# EAGLE schematic ll-tester (EAGLE 9.6.2)
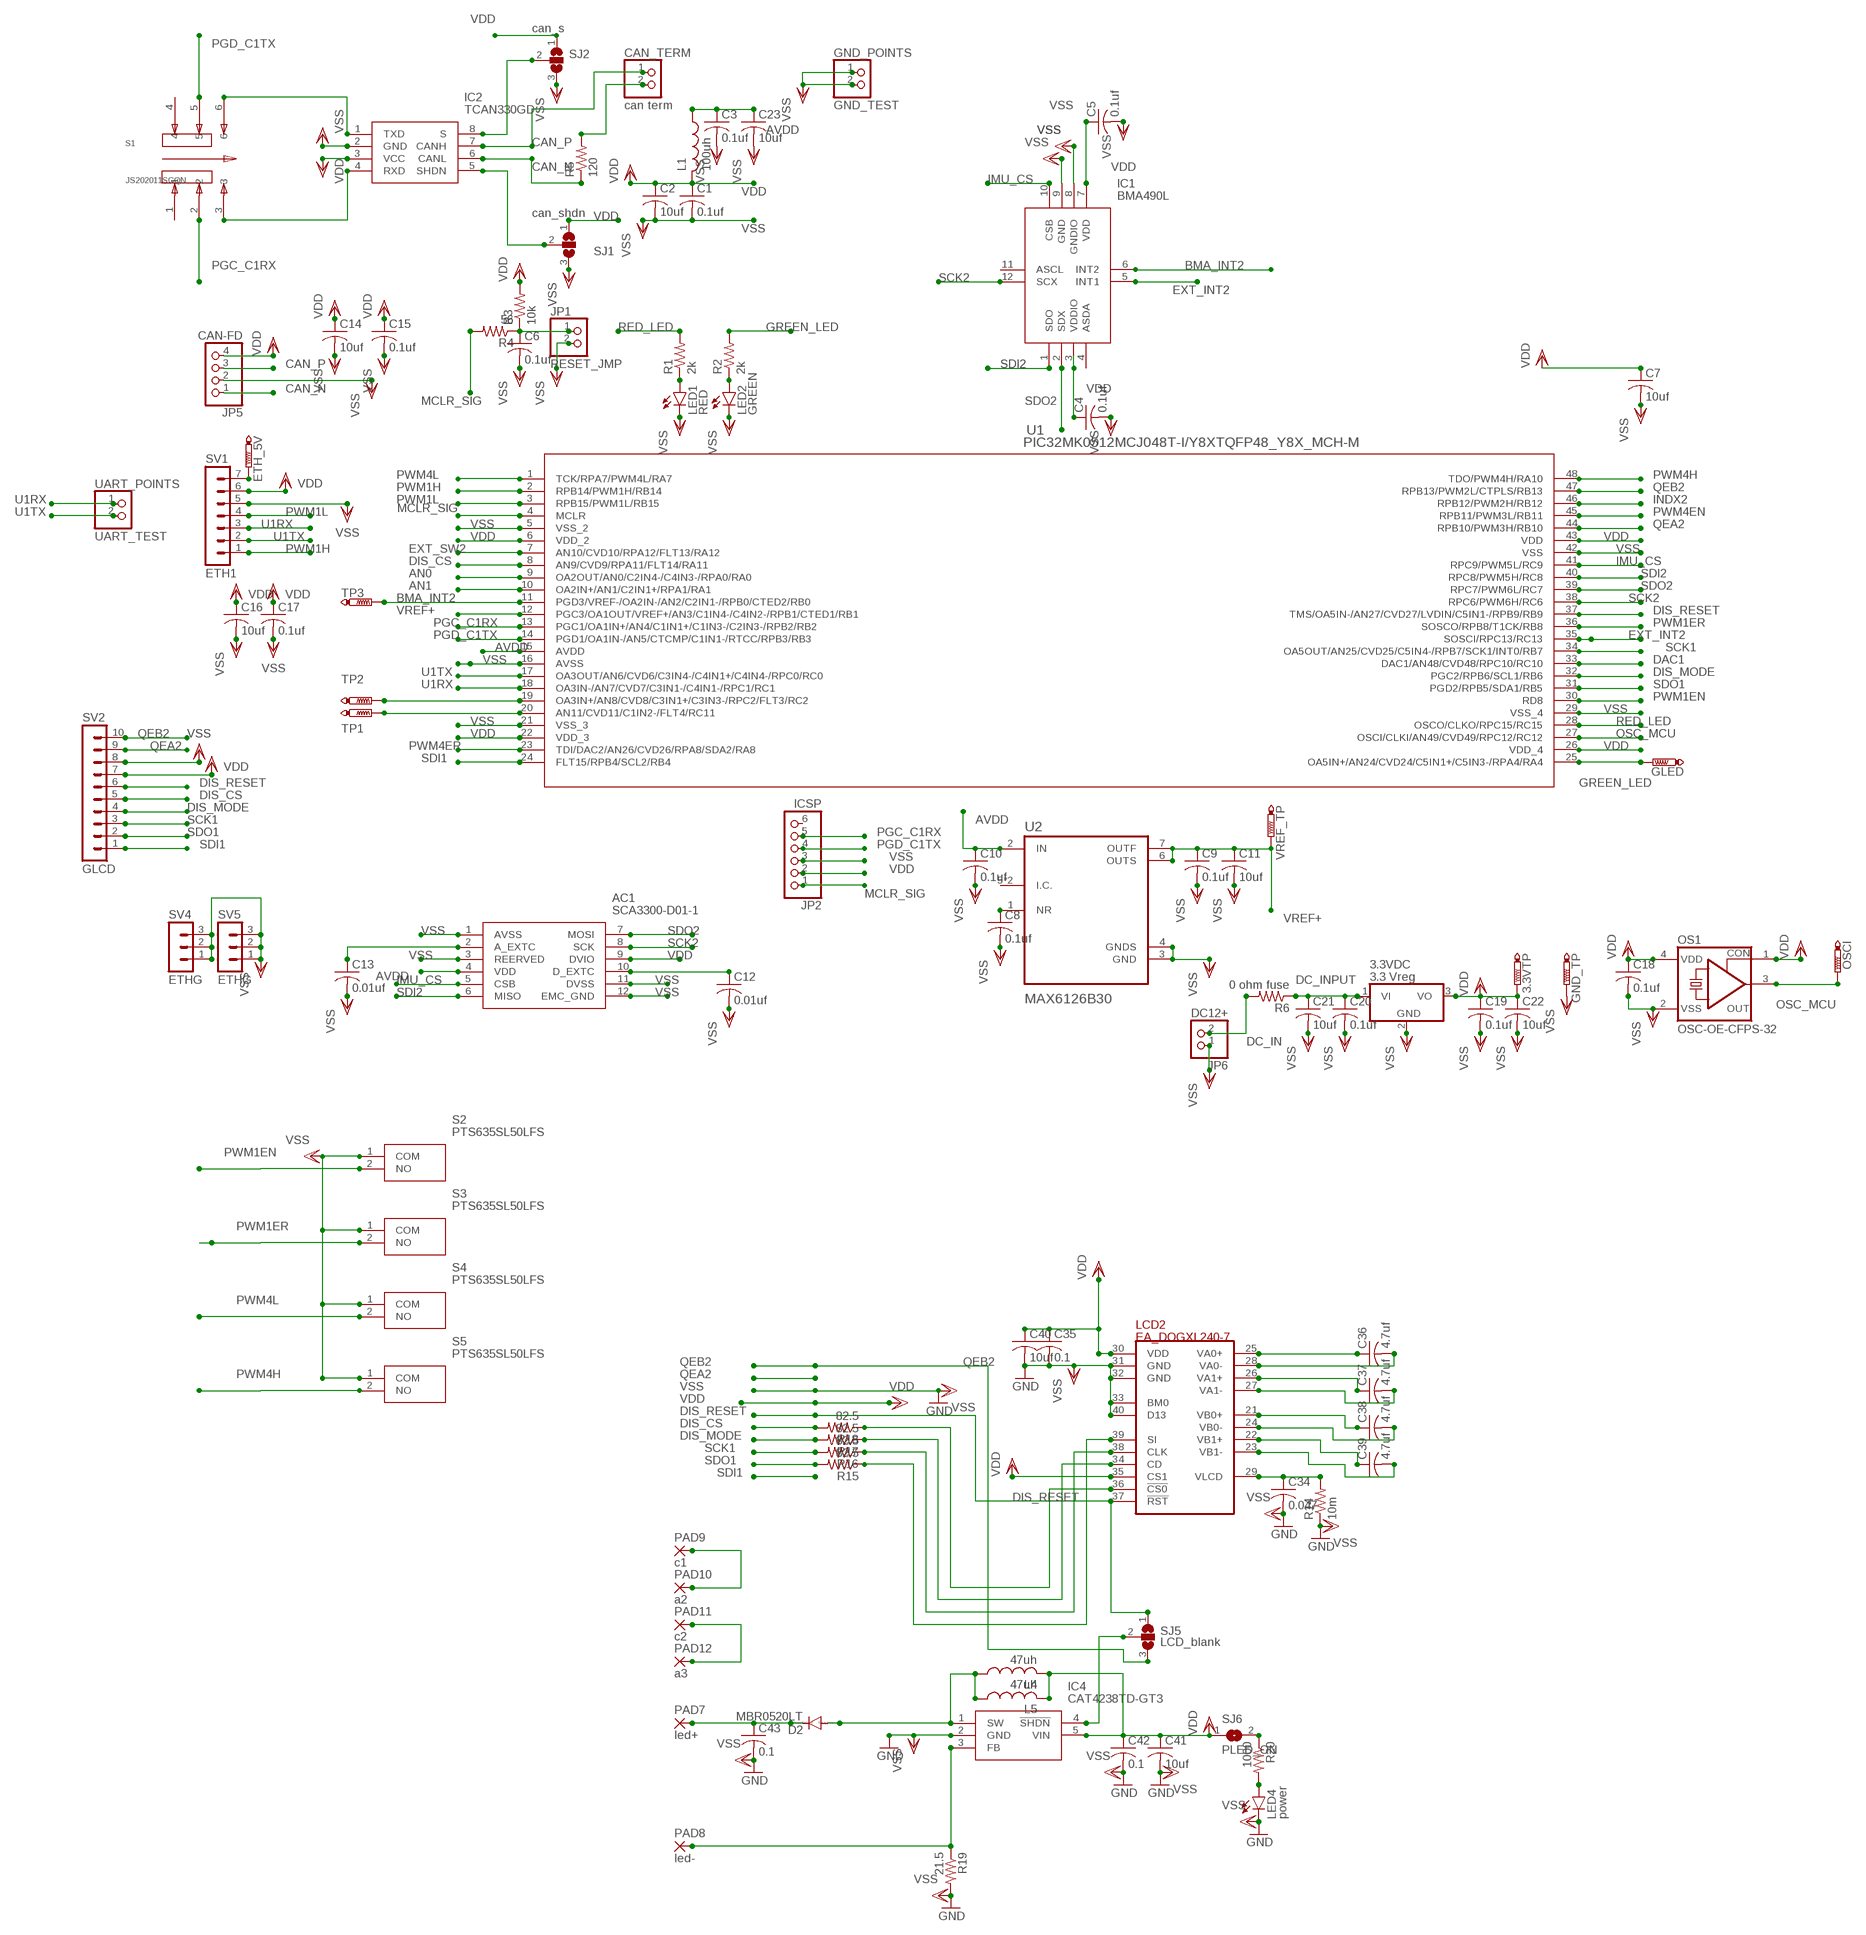
[diagram p0: schematic, sheet 1]

## Parts
3.3VDC  3.3 Vreg  7805TV  [TO220V]
3.3VTP  PTR1PAD1-13  [P1-13]
AC1  SCA3300-D01-1  [SCA3300]
C1  0.1uf  C-USC0805  [C0805]
C2  10uf  C-USC0805  [C0805]
C3  0.1uf  C-USC0805  [C0805]
C4  0.1uf  C-USC0805  [C0805]
C5  0.1uf  C-USC0805  [C0805]
C6  0.1uf  C-USC0805  [C0805]
C7  10uf  C-USC0805  [C0805]
C8  0.1uf  C-USC0805  [C0805]
C9  0.1uf  C-USC0805  [C0805]
C10  0.1uf  C-USC0805  [C0805]
C11  10uf  C-USC0805  [C0805]
C12  0.01uf  C-USC0805  [C0805]
C13  0.01uf  C-USC0805  [C0805]
C14  10uf  C-USC0805  [C0805]
C15  0.1uf  C-USC0805  [C0805]
C16  10uf  C-USC0805  [C0805]
C17  0.1uf  C-USC0805  [C0805]
C18  0.1uf  C-USC0805  [C0805]
C19  0.1uf  C-USC0805  [C0805]
C20  0.1uf  C-USC0805  [C0805]
C21  10uf  C-USC0805  [C0805]
C22  10uf  C-USC0805  [C0805]
C23  10uf  C-USC0805  [C0805]
C34  0.047  C-USC1206  [C1206]
C35  0.1  C-USC1206  [C1206]
C36  4.7uf  C-USC1206  [C1206]
C37  4.7uf  C-USC1206  [C1206]
C38  4.7uf  C-USC1206  [C1206]
C39  4.7uf  C-USC1206  [C1206]
C40  10uf  C-USC1206  [C1206]
C41  10uf  C-USC1206  [C1206]
C42  0.1  C-USC1206  [C1206]
C43  0.1  C-USC1206  [C1206]
CAN_TERM  can term  PINHD-1X2  [1X02]
D2  MBR0520LT  [SOD123]
ETH_5V  PTR1PAD1-13  [P1-13]
GLED  PTR1PAD1-13  [P1-13]
GND_POINTS  GND_TEST  PINHD-1X2  [1X02]
GND_TP  PTR1PAD1-13  [P1-13]
IC1  BMA490L  [BMA490L]
IC2  TCAN330GD  [SOIC127P600X175-8N]
IC4  CAT4238TD-GT3  [SOT95P280X100-5N]
JP1  RESET_JMP  PINHD-1X2  [1X02]
JP2  ICSP  PINHD-1X6  [1X06]
JP5  CAN-FD  PINHD-1X4/90  [1X04/90]
JP6  DC12+  PINHD-1X2  [1X02]
L1  100uh  L-USL3216C  [L3216C]
L4  47uh  L-US0204/5  [0204/5]
L5  47uh  L-USL2012C  [L2012C]
LCD2  EA_DOGXL240-7  [EA_DOGXL240-7]
LED1  RED  LEDCHIPLED_0603  [CHIPLED_0603]
LED2  GREEN  LEDCHIPLED_0603  [CHIPLED_0603]
LED4  power  LEDSML0805  [SML0805]
OS1  OSC-OE-CFPS-32  [7.2X5.2-4-PAD]
OSCI  PTR1PAD1-13  [P1-13]
PAD7  led+  1,6/0,8  [1,6/0,8]
PAD8  led-  1,6/0,8  [1,6/0,8]
PAD9  c1  1,6/0,8  [1,6/0,8]
PAD10  a2  1,6/0,8  [1,6/0,8]
PAD11  c2  1,6/0,8  [1,6/0,8]
PAD12  a3  1,6/0,8  [1,6/0,8]
R1  2k  R-US_M0805  [M0805]
R2  2k  R-US_M0805  [M0805]
R3  10k  R-US_M0805  [M0805]
R4  56  R-US_M0805  [M0805]
R5  120  R-US_M0805  [M0805]
R6  0 ohm fuse  R-US_M1206  [M1206]
R14  10m  R-US_R0805  [R0805]
R15  82.5  R-US_R0805  [R0805]
R16  82.5  R-US_R0805  [R0805]
R17  82.5  R-US_R0805  [R0805]
R18  82.5  R-US_R0805  [R0805]
R19  21.5  R-US_R0805  [R0805]
R20  1000  R-US_R0805  [R0805]
S1  JS202011SCQN  [SW_JS202011SCQN]
S2  PTS635SL50LFS  [PTS635SL50LFS]
S3  PTS635SL50LFS  [PTS635SL50LFS]
S4  PTS635SL50LFS  [PTS635SL50LFS]
S5  PTS635SL50LFS  [PTS635SL50LFS]
SJ1  can_shdn  SJ2W  [SJ_2]
SJ2  can_s  SJ2W  [SJ_2]
SJ5  LCD_blank  SJ2W  [SJ_2]
SJ6  PLED_ON  SJ  [SJ]
SV1  ETH1  MA07-1  [MA07-1]
SV2  GLCD  MA10-1  [MA10-1]
SV4  ETHG  MA03-1  [MA03-1]
SV5  ETHG  MA03-1  [MA03-1]
TP1  PTR1PAD1-13  [P1-13]
TP2  PTR1PAD1-13  [P1-13]
TP3  PTR1PAD1-13  [P1-13]
U1  PIC32MK0512MCJ048T-I/Y8XTQFP48_Y8X_MCH-M  [TQFP48_Y8X_MCH-M]
U2  MAX6126B30  [SOP65P490X110-8N]
UART_POINTS  UART_TEST  PINHD-1X2  [1X02]
VREF_TP  PTR1PAD1-13  [P1-13]

## Nets
AN0: U1.9(OA2OUT/AN0/C2IN4-/C4IN3-/RPA0/RA0)
AN1: U1.10(OA2IN+/AN1/C2IN1+/RPA1/RA1)
AVDD [led]: AC1.4(VDD) C3.1 C10.1 C23.1 L1.1 U1.15(AVDD) U2.2(IN)
BMA_INT2: IC1.6(INT2) TP3.TP U1.11(PGD3/VREF-/OA2IN-/AN2/C2IN1-/RPB0/CTED2/RB0)
CAN_N [diff_can]: IC2.6(CANL) JP5.1 R5.1
CAN_P [diff_can]: CAN_TERM.1 IC2.7(CANH) JP5.3
DAC1: U1.33(DAC1/AN48/CVD48/RPC10/RC10)
DC_IN [icurrent]: JP6.2 R6.2
DC_INPUT [icurrent]: 3.3VDC.1(VI) C20.1 C21.1 R6.1
DIS_CS: R18.2 SV2.5 U1.8(AN9/CVD9/RPA11/FLT14/RA11)
DIS_MODE: R17.2 SV2.4 U1.32(PGC2/RPB6/SCL1/RB6)
DIS_RESET: LCD2.37(!RST!) SJ5.1 SV2.6 U1.37(TMS/OA5IN-/AN27/CVD27/LVDIN/C5IN1-/RPB9/RB9)
EXT_INT2: IC1.5(INT1) U1.35(SOSCI/RPC13/RC13)
EXT_SW2: U1.7(AN10/CVD10/RPA12/FLT13/RA12)
GREEN_LED: GLED.TP R2.2 U1.25(OA5IN+/AN24/CVD24/C5IN1+/C5IN3-/RPA4/RA4)
IMU_CS: AC1.5(CSB) IC1.10(CSB) U1.41(RPC9/PWM5L/RC9)
INDX2: U1.46(RPB12/PWM2H/RB12)
MCLR_SIG: JP2.1 R4.2 U1.4(MCLR)
N$1: LED1.A R1.1
N$2: LED2.A R2.1
N$3: C6.1 JP1.1 R3.1 R4.1
N$4: C8.1 U2.1(NR)
N$5: TP1.TP U1.20(AN11/CVD11/C1IN2-/FLT4/RC11)
N$6: TP2.TP U1.19(OA3IN+/AN8/CVD8/C3IN1+/C3IN3-/RPC2/FLT3/RC2)
N$7: AC1.10(D_EXTC) C12.1
N$8: ETH_5V.TP SV1.7
N$9: AC1.2(A_EXTC) C13.1
N$10: IC2.1(TXD) S1.6
N$11: IC2.4(RXD) S1.3
N$12: IC2.5(SHDN) SJ1.2
N$13: IC2.8(S) SJ2.2
N$15: CAN_TERM.2 R5.2
N$44: C34.1 LCD2.29(VLCD) R14.2
N$46: C36.1 LCD2.25(VA0+)
N$47: C36.2 LCD2.28(VA0-)
N$48: C37.1 LCD2.26(VA1+)
N$49: C37.2 LCD2.27(VA1-)
N$50: C38.1 LCD2.21(VB0+)
N$51: C38.2 LCD2.24(VB0-)
N$52: C39.1 LCD2.22(VB1+)
N$53: C39.2 LCD2.23(VB1-)
N$54: LCD2.36(!CS0!) R18.1
N$55: LCD2.34(CD) R17.1
N$56: LCD2.38(CLK) R16.1
N$57: LCD2.39(SI) R15.1
N$65: D2.A IC4.1(SW) L4.1 L5.1
N$66 [led]: IC4.3(FB) PAD8.1(P) R19.1
N$67 [led]: C43.1 D2.C PAD7.1(P)
N$68 [led]: PAD9.1(P) PAD10.1(P)
N$69 [led]: PAD11.1(P) PAD12.1(P)
N$70: IC4.4(!SHDN) SJ5.2
N$71: R20.1 SJ6.2
N$72: LED4.A R20.2
OSC_MCU: OS1.3(OUT) OSCI.TP U1.27(OSCI/CLKI/AN49/CVD49/RPC12/RC12)
PGC_C1RX: JP2.5 S1.2 U1.13(PGC1/OA1IN+/AN4/C1IN1+/C1IN3-/C2IN3-/RPB2/RB2)
PGD_C1TX: JP2.4 S1.5 U1.14(PGD1/OA1IN-/AN5/CTCMP/C1IN1-/RTCC/RPB3/RB3)
PWM1EN: S2.2(NO) U1.30(RD8)
PWM1ER: S3.2(NO) U1.36(SOSCO/RPB8/T1CK/RB8)
PWM1H: SV1.1 U1.2(RPB14/PWM1H/RB14)
PWM1L: SV1.4 U1.3(RPB15/PWM1L/RB15)
PWM4EN: U1.45(RPB11/PWM3L/RB11)
PWM4ER: U1.23(TDI/DAC2/AN26/CVD26/RPA8/SDA2/RA8)
PWM4H: S5.2(NO) U1.48(TDO/PWM4H/RA10)
PWM4L: S4.2(NO) U1.1(TCK/RPA7/PWM4L/RA7)
QEA2: SV2.9 U1.44(RPB10/PWM3H/RB10)
QEB2: SJ5.3 SV2.10 U1.47(RPB13/PWM2L/CTPLS/RB13)
RED_LED: R1.2 U1.28(OSCO/CLKO/RPC15/RC15)
SCK1: R16.2 SV2.3 U1.34(OA5OUT/AN25/CVD25/C5IN4-/RPB7/SCK1/INT0/RB7)
SCK2: AC1.8(SCK) IC1.12(SCX) U1.38(RPC6/PWM6H/RC6)
SDI1: SV2.1 U1.24(FLT15/RPB4/SCL2/RB4)
SDI2: AC1.6(MISO) IC1.1(SDO) U1.40(RPC8/PWM5H/RC8)
SDO1: R15.2 SV2.2 U1.31(PGD2/RPB5/SDA1/RB5)
SDO2: AC1.7(MOSI) IC1.2(SDX) U1.39(RPC7/PWM6L/RC7)
U1RX: SV1.3 U1.18(OA3IN-/AN7/CVD7/C3IN1-/C4IN1-/RPC1/RC1) UART_POINTS.1
U1TX: SV1.2 U1.17(OA3OUT/AN6/CVD6/C3IN4-/C4IN1+/C4IN4-/RPC0/RC0) UART_POINTS.2
VDD [led]: 3.3VDC.3(VO) 3.3VTP.TP AC1.9(DVIO) C1.1 C2.1 C4.1 C5.1 C7.1 C14.1 C15.1 C16.1 C17.1 C18.1 C19.1 C22.1 C35.1 C40.1 C41.1 C42.1 IC1.3(VDDIO) IC1.7(VDD) IC2.3(VCC) IC4.5(VIN) JP2.2 JP5.4 L1.2 L4.2 L5.2 LCD2.30(VDD) LCD2.35(CS1) OS1.1(CON) OS1.4(VDD) R3.2 SJ1.1 SJ2.1 SJ6.1 SV1.6 SV2.7 U1.6(VDD_2) U1.22(VDD_3) U1.26(VDD_4) U1.43(VDD)
VREF+: C9.1 C11.1 U1.12(PGC3/OA1OUT/VREF+/AN3/C1IN4-/C4IN2-/RPB1/CTED1/RB1) U2.6(OUTS) U2.7(OUTF) VREF_TP.TP
VSS [led]: 3.3VDC.2(GND) AC1.1(AVSS) AC1.3(REERVED) AC1.11(DVSS) AC1.12(EMC_GND) C1.2 C2.2 C3.2 C4.2 C5.2 C6.2 C7.2 C8.2 C9.2 C10.2 C11.2 C12.2 C13.2 C14.2 C15.2 C16.2 C17.2 C18.2 C19.2 C20.2 C21.2 C22.2 C23.2 C34.2 C35.2 C40.2 C41.2 C42.2 C43.2 GND_POINTS.1 GND_POINTS.2 GND_TP.TP IC1.8(GNDIO) IC1.9(GND) IC2.2(GND) IC4.2(GND) JP1.2 JP2.3 JP5.2 JP6.1 LCD2.31(GND) LCD2.32(GND) LCD2.33(BM0) LCD2.40(D13) LED1.C LED2.C LED4.C OS1.2(VSS) R14.1 R19.2 S2.1(COM) S3.1(COM) S4.1(COM) S5.1(COM) SJ1.3 SJ2.3 SV1.5 SV2.8 SV4.1 SV4.2 SV4.3 SV5.1 SV5.2 SV5.3 U1.5(VSS_2) U1.16(AVSS) U1.21(VSS_3) U1.29(VSS_4) U1.42(VSS) U2.3(GND) U2.4(GNDS) ; supply symbol labelled GND
Unconnected: IC1.4(ASDA) IC1.11(ASCL) JP2.6 S1.1 S1.4 U2.5(I.C.) U2.8(I.C.)

## Library data of the parts
3.3VDC = linear:78*: Positive VOLTAGE REGULATOR Source: http://cache.national.com/ds/LM/LM78L05.pdf http://www.fairchildsemi.com/ds/LM/LM7805.pdf
3.3VTP ETH_5V GLED GND_TP OSCI TP1-TP3 VREF_TP = testpad:PTR1: TEST PIN
AC1 = SCA3300-D01-1:SCA3300-D01-1: Murata SCA3300-D01-1, 3-Axis Accelerometer, +/-1.5 +/-6g, 3 3.6 V, SPI, DFL/SMD 12-Pin Source: Datasheet <https://www.murata.com/~/media/webrenewal/products/sensor/accel/sca3300/sca3300-d01 industrial 3-axis accelerometer datasheet _a1.ashx> Check availability <https://pricing.snapeda.com/parts/SCA3300-D01-1/Murata%20Electronics/view-part?ref=eda>; AVAILABILITY: In Stock; DESCRIPTION: Accelerometer X, Y, Z Axis ±1.5g, 3g, 6g - -; MF: Murata Electronics; MP: SCA3300-D01-1; PACKAGE: Nonstandard Murata; PRICE: None; PURCHASE-URL: https://pricing.snapeda.com/search/part/SCA3300-D01-1/?ref=eda
C1-C23 C34-C43 = rcl:C-US: CAPACITOR, American symbol; SPICEPREFIX: C
CAN_TERM GND_POINTS JP1 JP6 UART_POINTS = pinhead:PINHD-1X2: PIN HEADER
D2 = diode:MBR0520LT: SCHOTTKY BARRIER RECTIFIER Source: http://onsemi.com .. MBR0520LT1-D.pdf
IC1 = SamacSys_Parts:BMA490L: Accelerometers High-performance longevity acceleration sensor Source: Datasheet <https://www.mouser.es/datasheet/2/783/bst-bma490l-ds000-1878796.pdf>; DESCRIPTION: Accelerometers High-performance longevity acceleration sensor; HEIGHT: 1mm; MANUFACTURER_NAME: Bosch Sensortec; MANUFACTURER_PART_NUMBER: BMA490L; MOUSER_PART_NUMBER: 262-BMA490L; MOUSER_PRICE-STOCK: https://www.mouser.co.uk/ProductDetail/Bosch-Sensortec/BMA490L?qs=7MVldsJ5UawjTpioRTbJPQ%3D%3D
IC2 = TCAN330GD:TCAN330GD: 3.3-V CAN Transceivers with CAN FD (Flexible Data Rate) Source: Datasheet <http://www.ti.com/lit/gpn/tcan330g>; DESCRIPTION: 3.3-V CAN Transceivers with CAN FD (Flexible Data Rate); HEIGHT: 1.75mm; MANUFACTURER_NAME: Texas Instruments; MANUFACTURER_PART_NUMBER: TCAN330GD; MOUSER_PART_NUMBER: 595-TCAN330GD; MOUSER_PRICE-STOCK: https://www.mouser.co.uk/ProductDetail/Texas-Instruments/TCAN330GD?qs=9DwIlvx97ae6H3qgocd9Aw%3D%3D
IC4 = CAT4238TD-GT3:CAT4238TD-GT3: Source: Datasheet <http://www.onsemi.com/pub/Collateral/CAT4238-D.PDF>; ARROW_PART_NUMBER: CAT4238TD-GT3; ARROW_PRICE-STOCK: https://www.arrow.com/en/products/cat4238td-gt3/on-semiconductor; HEIGHT: 1mm; MANUFACTURER_NAME: ON Semiconductor; MANUFACTURER_PART_NUMBER: CAT4238TD-GT3; MOUSER_PART_NUMBER: 698-CAT4238TDG; MOUSER_PRICE-STOCK: https://www.mouser.co.uk/ProductDetail/ON-Semiconductor/CAT4238TD-GT3?qs=9dFQwQorgSxpbLptXYtgxg%3D%3D
JP2 = pinhead:PINHD-1X6: PIN HEADER
JP5 = pinhead:PINHD-1X4: PIN HEADER
L1 L4 L5 = rcl:L-US: INDUCTOR, American symbol; SPICEPREFIX: L
LCD2 = ea_v66:EA_DOGXL240-7
LED1 LED2 LED4 = led:LED: LED OSRAM: - CHIPLED LG R971, LG N971, LY N971, LG Q971, LY Q971, LO R971, LY R971 LH N974, LH R974 LS Q976, LO Q976, LY Q976 LO Q996 - Hyper CHIPLED LW Q18S LB Q993, LB Q99A, LB R99A - SideLED LS A670, LO A670, LY A670, LG A670, LP A670 LB A673, LV A673, LT A673, LW A673 LH A674 LY A675 LS A676, LA A676, LO A676, LY A676, LW A676 LS A679, LY A679, LG A679 - Hyper Micro SIDELED® LS Y876, LA Y876, LO Y876, LY Y876 LT Y87S - SmartLED LW L88C, LW L88S LB L89C, LB L89S, LG L890 LS L89K, LO L89K, LY L89K LS L896, LA L896, LO L896, LY L896 - TOPLED LS T670, LO T670, LY T670, LG T670, LP T670 LSG T670, LSP T670, LSY T670, LOP T670, LYG T670 LG T671, LOG T671, LSG T671 LB T673, LV T673, LT T673, LW T673 LH T674 LS T676, LA T676, LO T676, LY T676, LB T676, LH T676, LSB T676, LW T676 LB T67C, LV T67C, LT T67C, LS T67K, LO T67K, LY T67K, LW E67C LS E67B, LA E67B, LO E67B, LY E67B, LB E67C, LV E67C, LT E67C LW T67C LS T679, LY T679, LG T679 LS T770, LO T770, LY T770, LG T770, LP T770 LB T773, LV T773, LT T773, LW T773 LH T774 LS E675, LA E675, LY E675, LS T675 LS T776, LA T776, LO T776, LY T776, LB T776 LHGB T686 LT T68C, LB T68C - Hyper Mini TOPLED® LB M676 - Mini TOPLED Santana® LG M470 LS M47K, LO M47K, LY M47K Source: http://www.osram.convergy.de LUXEON: - LUMILED® LXK2-PW12-R00, LXK2-PW12-S00, LXK2-PW14-U00, LXK2-PW14-V00 LXK2-PM12-R00, LXK2-PM12-S00, LXK2-PM14-U00 LXK2-PE12-Q00, LXK2-PE12-R00, LXK2-PE12-S00, LXK2-PE14-T00, LXK2-PE14-U00 LXK2-PB12-K00, LXK2-PB12-L00, LXK2-PB12-M00, LXK2-PB14-N00, LXK2-PB14-P00, LXK2-PB14-Q00 LXK2-PR12-L00, LXK2-PR12-M00, LXK2-PR14-Q00, LXK2-PR14-R00 LXK2-PD12-Q00, LXK2-PD12-R00, LXK2-PD12-S00 LXK2-PH12-R00, LXK2-PH12-S00 LXK2-PL12-P00, LXK2-PL12-Q00, LXK2-PL12-R00 Source: www.luxeon.com KINGBRIGHT: KA-3528ASYC Source: www.kingbright.com
OS1 = IQD-Frequency-Products:OSC-OE: OSCILLATOR WITH OE
PAD7-PAD12 = wirepad:1,6/0,8: THROUGH-HOLE PAD
R1-R6 R14-R20 = rcl:R-US_: RESISTOR, American symbol; SPICEPREFIX: R
S1 = JS202011SCQN_fixed:JS202011SCQN: JS Series DPDT On-On Gull Wing Surface Mount Subminiature Slide Switch; AVAILABILITY: Unavailable; DESCRIPTION: JS Series DPDT On-On Gull Wing Surface Mount Subminiature Slide Switch; MF: C&K; MP: JS202011SCQN; PACKAGE: None; PRICE: None
S2-S5 = PTS635SL50LFS:PTS635SL50LFS: Tactile Switches TACT Source: Datasheet; DESCRIPTION: Tactile Switches TACT; HEIGHT: 5mm; MANUFACTURER_NAME: C & K COMPONENTS; MANUFACTURER_PART_NUMBER: PTS635SL50LFS; MOUSER_PART_NUMBER: 611-PTS635SL50LFS; MOUSER_PRICE-STOCK: https://www.mouser.co.uk/ProductDetail/CK/PTS635SL50LFS?qs=u2NJ%252B70r0gpkXWlfBVOo5A%3D%3D
SJ1 SJ2 SJ5 = jumper:SJ2W: SMD solder JUMPER
SJ6 = jumper:SJ: SMD solder JUMPER
SV1 = con-lstb:MA07-1: PIN HEADER; OC_FARNELL: unknown; OC_NEWARK: unknown
SV2 = con-lstb:MA10-1: PIN HEADER; OC_FARNELL: unknown; OC_NEWARK: unknown
SV4 SV5 = con-lstb:MA03-1: PIN HEADER; OC_FARNELL: unknown; OC_NEWARK: unknown
U1 = 2022-08-07_22-50-41_Library:PIC32MK0512MCJ048T-I/Y8X; COPYRIGHT: Copyright (C) 2022 Ultra Librarian. All rights reserved.; MANUFACTURER_PART_NUMBER: PIC32MK0512MCJ048T-I/Y8X; MFR_NAME: Microchip
U2 = MAX6126B30:MAX6126B30; DESCRIPTION: Series Voltage Reference IC Fixed 3V V ±0.1% 10 mA 8-uMAX-EP|8-uSOP-EP; DIGI-KEY_PART_NUMBER: MAX6126B30+T-ND; MF: Maxim Integrated; MP: MAX6126B30+T; PACKAGE: MICRO MAX-8 Maxim; PURCHASE-URL: https://pricing.snapeda.com/search/part/MAX6126B30+T/?ref=eda

## Net classes
1 icurrent: width 0.305 mm
2 led: width 0.305 mm
3 diff_can: width 0.051 mm